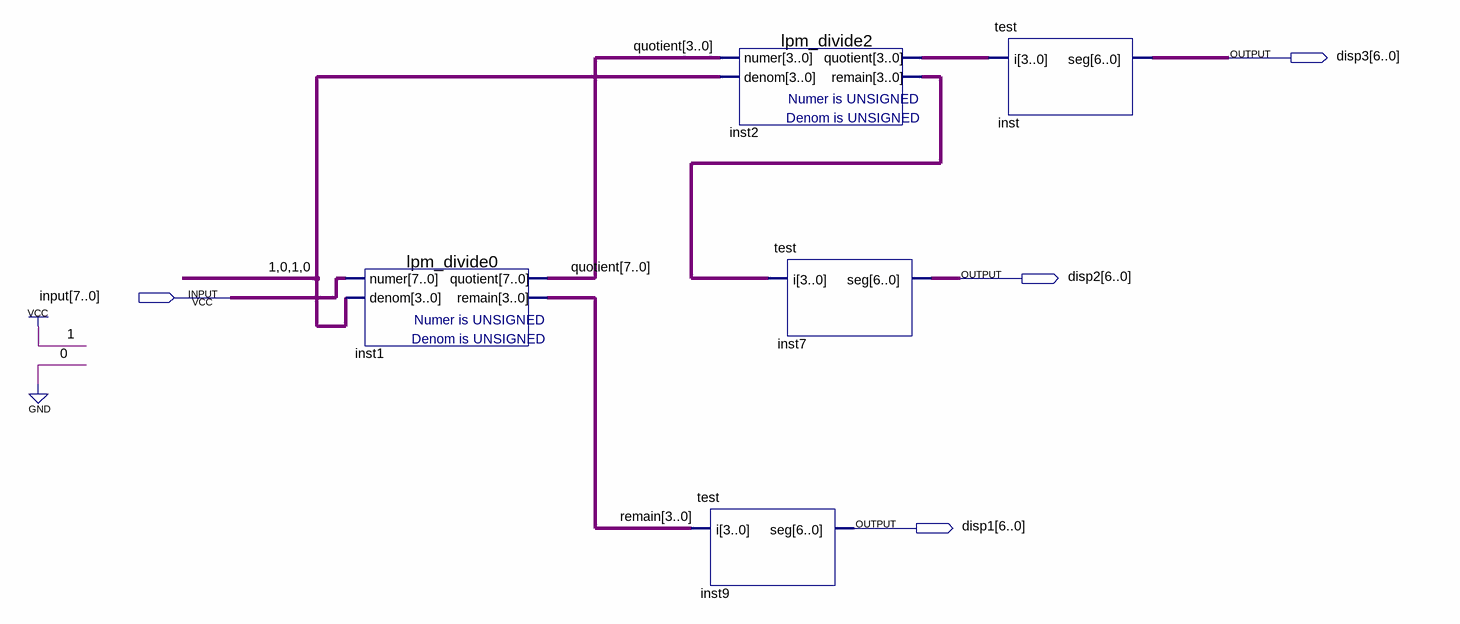
[diagram p0: schematic sheet]
// Quartus schematic positivenumberconversion.bdf as structural Verilog: 5 symbols, 4 pins
module positivenumberconversion (
  input  [7:0] \input ,
  output [6:0] disp3,
  output [6:0] disp2,
  output [6:0] disp1
);

  wire [3:0] inst2_quotient, inst2_remain, remain;
  wire [7:0] quotient;

  lpm_divide0 inst1 (.numer(\input ), .denom(4'b1010), .quotient(quotient), .remain(remain));
  lpm_divide2 inst2 (.numer(quotient[3:0]), .denom(4'b1010), .quotient(inst2_quotient), .remain(inst2_remain));
  test inst9 (.i(remain), .seg(disp1));
  test inst7 (.i(inst2_remain), .seg(disp2));
  test inst (.i(inst2_quotient), .seg(disp3));
endmodule
